# Altium schematic sheet 02_Top_Level.SchDoc: <Project Name>
size A3; ApprovedBy: <Appr.>; Author: <Author>; CompanyName: Infineon Technologies AG; Engineer: <Rel.>; Organization: Infineon Technologies AG; Address1: COM AC SDC SD3; Address2: Am Campeon 1-12  -  85579 Neubiberg  -  Germany; Address3: 85579 Neubiberg; Address4: Germany; Revision: <Rev.>; Release: RC00; PageSetup: Record=PageOptions|CenterHorizontal=True|CenterVertical=True|PrintScale=1.01|XCorrection=1.00|YCorrection=1.00|PrintKind=0|BorderSize=5000000|LeftOffset=0|BottomOffset=0|Orientation=2|PaperLength=1000|PaperWidth=1000|Scale=100|PaperSource=7|PrintQuality=-4|MediaType=1|DitherType=10|PaperKind=A3|PrintScaleMode=1; Doc_ConfidentialStatus: <Doc_ConfidentialStatus>; Doc_Preliminary: <Doc_Preliminary>
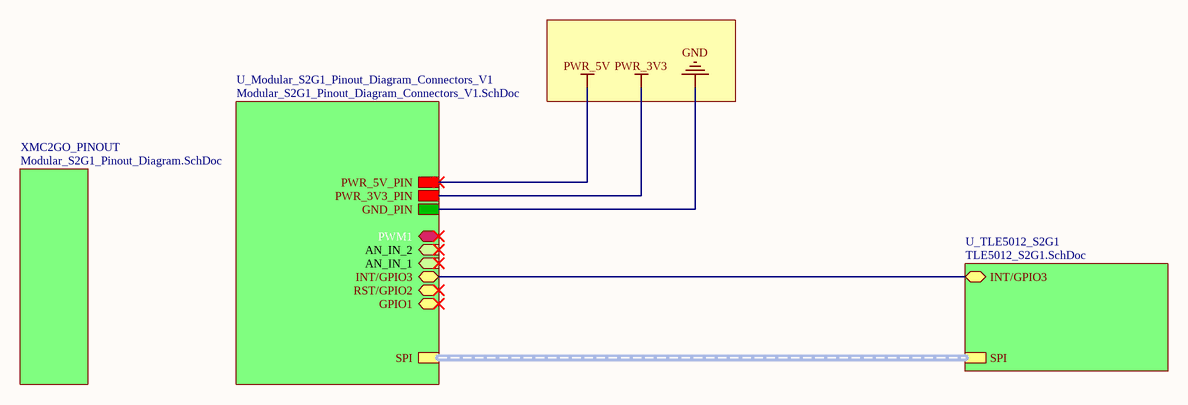
[diagram p0: 02_Top_Level.SchDoc]

## Sub-sheets
U_Modular_S2G1_Pinout_Diagram_Connectors_V1 = Modular_S2G1_Pinout_Diagram_Connectors_V1.SchDoc: INT/GPIO3 (bidir), PWR_5V_PIN, PWR_3V3_PIN, GND_PIN, AN_IN_1 (in), PWM1 (bidir), AN_IN_2 (in), RST/GPIO2 (bidir), GPIO1 (bidir), SPI
U_TLE5012_S2G1 = TLE5012_S2G1.SchDoc: INT/GPIO3 (bidir), SPI (harness SPI)
XMC2GO_PINOUT = Modular_S2G1_Pinout_Diagram.SchDoc: no entries

## Nets
GND: sheet U_Modular_S2G1_Pinout_Diagram_Connectors_V1/GND_PIN
PWR_3V3: sheet U_Modular_S2G1_Pinout_Diagram_Connectors_V1/PWR_3V3_PIN
PWR_5V: sheet U_Modular_S2G1_Pinout_Diagram_Connectors_V1/PWR_5V_PIN
(unnamed): sheet U_Modular_S2G1_Pinout_Diagram_Connectors_V1/INT/GPIO3, sheet U_TLE5012_S2G1/INT/GPIO3

## Buses and harness runs
harness sheet U_Modular_S2G1_Pinout_Diagram_Connectors_V1/SPI = sheet U_TLE5012_S2G1/SPI

## Notes on the sheet
- Title
- Variant
- Approved
- Date:
- Author:
- Size:
- A3
- Document Name
- Time:
- SVN Revision:
- Rel.
- Rev.
- Sheet
- of